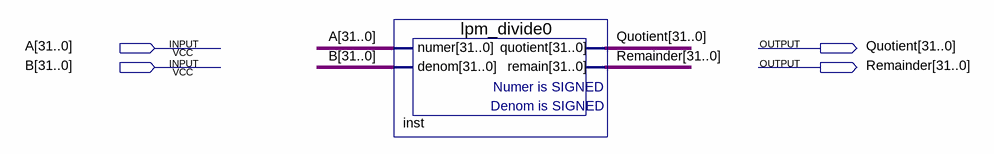
[diagram p0: schematic sheet]
// Quartus schematic divider.bdf as structural Verilog: 1 symbols, 4 pins
module divider (
  input  [31:0] A,
  input  [31:0] B,
  output [31:0] Quotient,
  output [31:0] Remainder
);

  lpm_divide0 inst (.numer(A), .denom(B), .quotient(Quotient), .remain(Remainder));
endmodule
